# EAGLE design giri-fu-hw (EAGLE 7.7.0)
giri-fu hardware v1.0
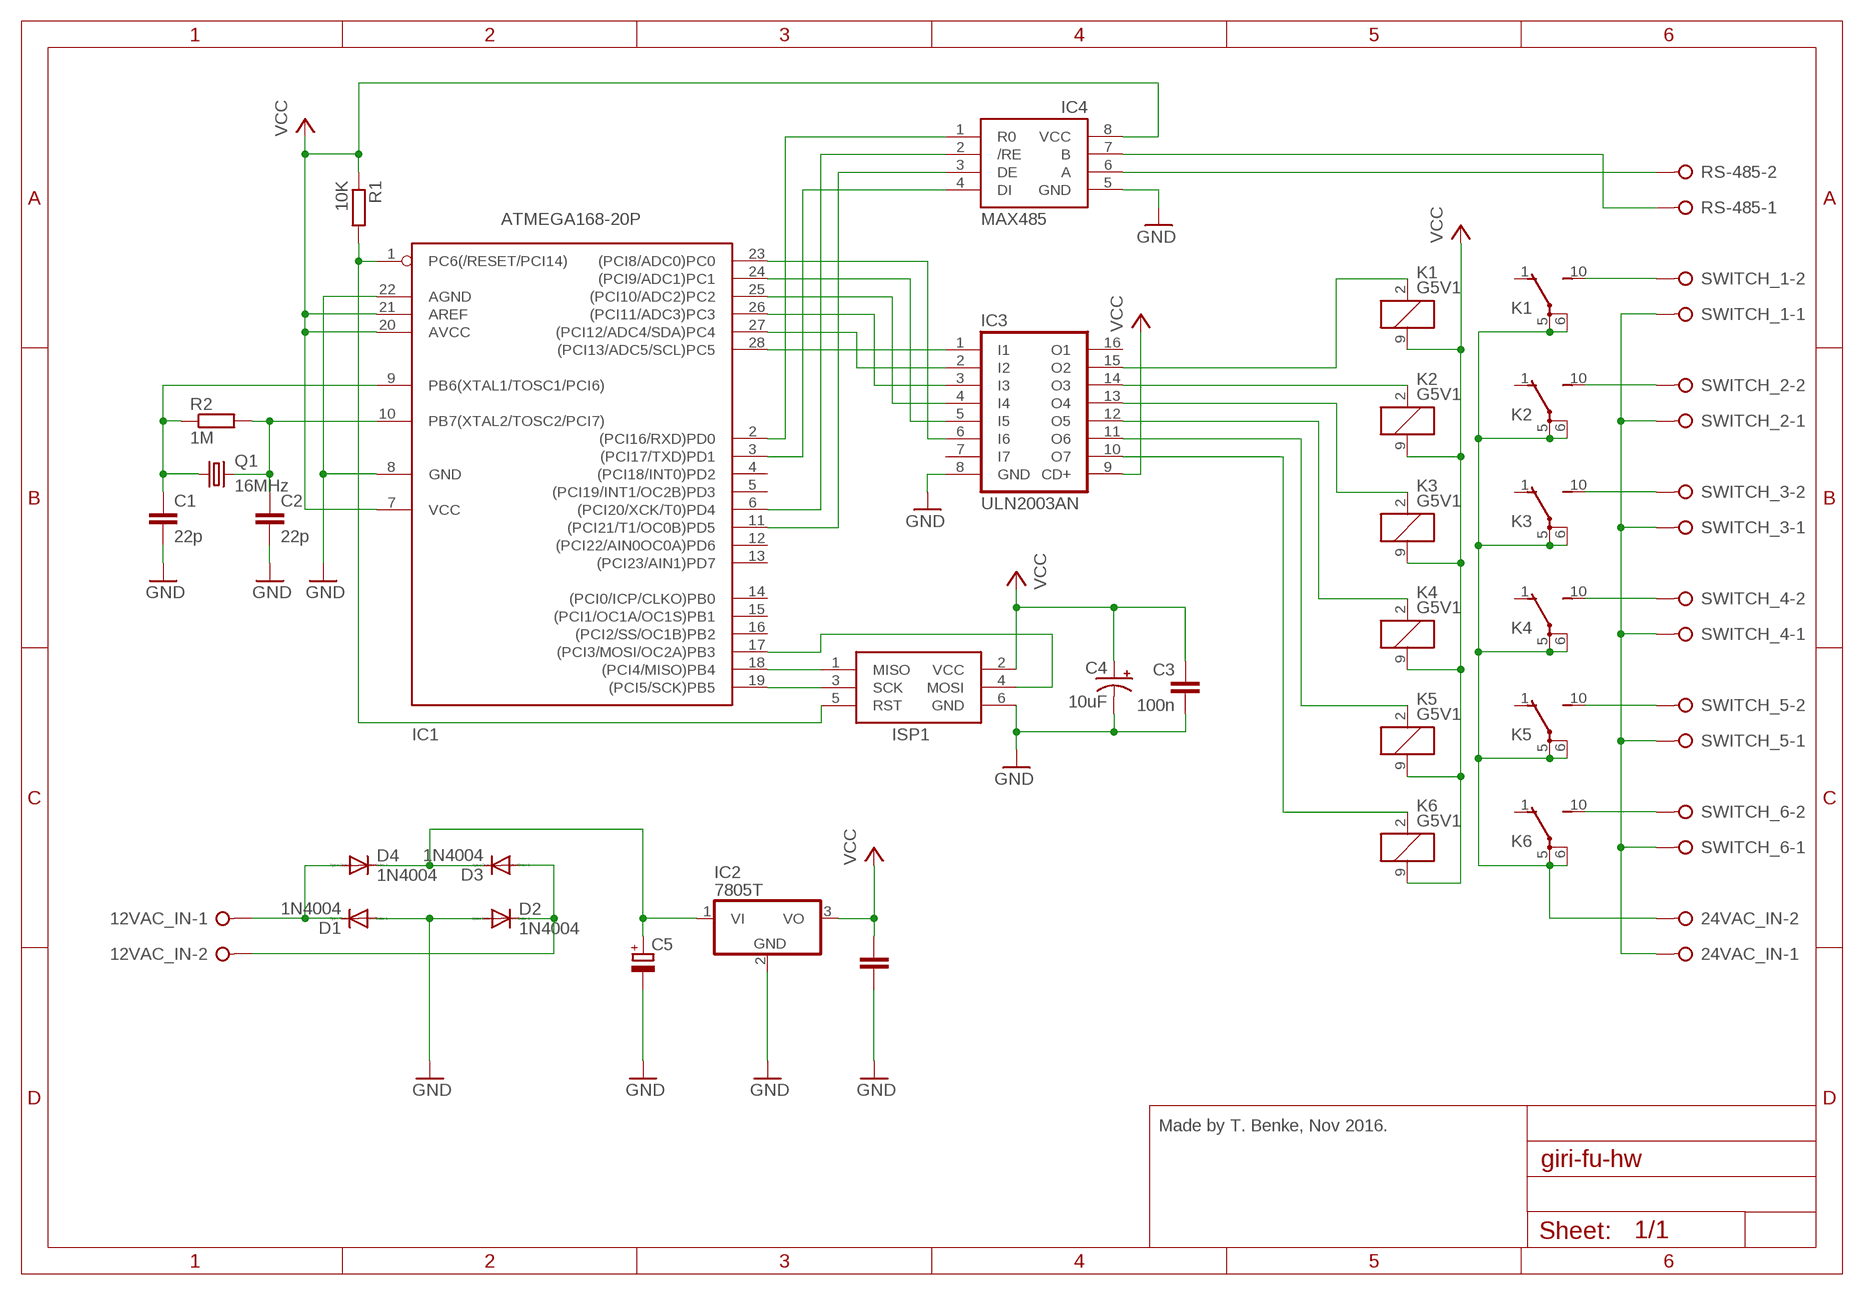
[diagram p0: schematic, sheet 1]

## Parts
12VAC_IN  W237-02P  [W237-132]
24VAC_IN  W237-02P  [W237-132]
C1  22p  C-EU025-025X050  [C025-025X050]
C2  22p  C-EU025-025X050  [C025-025X050]
C3  100n  C-EU025-025X050  [C025-025X050]
C4  10uF  CPOL-USE2-5  [E2-5]
C5  CPOL-EUE35-12AXIAL  [E35-12]
D1  1N4004  [DO41-10]
D2  1N4004  [DO41-10]
D3  1N4004  [DO41-10]
D4  1N4004  [DO41-10]
IC1  ATMEGA168-20P  [DIL28-3]
IC2  7805T  [TO220H]
IC3  ULN2003AN  [DIL16]
IC4  MAX485  [DIL08]
ISP1  AVRISP-6  [AVRISP]
K1  G5V1  [G5V1]
K2  G5V1  [G5V1]
K3  G5V1  [G5V1]
K4  G5V1  [G5V1]
K5  G5V1  [G5V1]
K6  G5V1  [G5V1]
Q1  16MHz  CRYSTALHC49U-V  [HC49U-V]
R1  10K  R-EU_0207/10  [0207/10]
R2  1M  R-EU_0207/10  [0207/10]
RS-485  W237-02P  [W237-132]
SWITCH_1  W237-02P  [W237-132]
SWITCH_2  W237-02P  [W237-132]
SWITCH_3  W237-02P  [W237-132]
SWITCH_4  W237-02P  [W237-132]
SWITCH_5  W237-02P  [W237-132]
SWITCH_6  W237-02P  [W237-132]

## Nets
GND: C1.2 C2.2 C3.2 C4.- C5.- D1.A D2.A IC1.8(GND) IC1.22(AGND) IC2.2(GND) IC3.8(GND) IC4.5(GND) ISP1.6(GND)
N$1: IC1.23((PCI8/ADC0)PC0) IC3.6(I6)
N$2: IC1.24((PCI9/ADC1)PC1) IC3.5(I5)
N$3: 24VAC_IN.2 K1.5(2:P) K1.6(2:P) K2.5(2:P) K2.6(2:P) K3.5(2:P) K3.6(2:P) K4.5(2:P) K4.6(2:P) K5.5(2:P) K5.6(2:P) K6.5(2:P) K6.6(2:P)
N$4: IC1.25((PCI10/ADC2)PC2) IC3.4(I4)
N$5: IC1.28((PCI13/ADC5/SCL)PC5) IC3.1(I1)
N$6: IC1.26((PCI11/ADC3)PC3) IC3.3(I3)
N$7: IC1.27((PCI12/ADC4/SDA)PC4) IC3.2(I2)
N$8: C3.1 C4.+ IC1.7(VCC) IC1.20(AVCC) IC1.21(AREF) IC2.3(VO) IC3.9(CD+) IC4.8(VCC) ISP1.2(VCC) K1.9 K2.9 K3.9 K4.9 K5.9 K6.9 R1.1 ; supply symbol labelled VCC
N$9: IC3.10(O7) K6.2
N$10: IC3.11(O6) K5.2
N$11: IC1.19((PCI5/SCK)PB5) ISP1.3(SCK)
N$12: IC1.17((PCI3/MOSI/OC2A)PB3) ISP1.4(MOSI)
N$13: IC1.1(PC6(/RESET/PCI14)) ISP1.5(RST) R1.2
N$14: C1.1 IC1.9(PB6(XTAL1/TOSC1/PCI6)) Q1.1 R2.1
N$15: C2.1 IC1.10(PB7(XTAL2/TOSC2/PCI7)) Q1.2 R2.2
N$16: IC1.18((PCI4/MISO)PB4) ISP1.1(MISO)
N$17: IC3.12(O5) K4.2
N$18: IC3.13(O4) K3.2
N$19: IC3.14(O3) K2.2
N$20: IC3.15(O2) K1.2
N$21: C5.+ D3.C D4.C IC2.1(VI)
N$22: 12VAC_IN.1 D1.C D4.A
N$23: 12VAC_IN.2 D2.C D3.A
N$24: IC4.6(A) RS-485.2
N$25: IC4.7(B) RS-485.1
N$26: IC1.2((PCI16/RXD)PD0) IC4.1(R0)
N$27: IC1.3((PCI17/TXD)PD1) IC4.4(DI)
N$28: K1.10(2:S) SWITCH_1.2
N$29: K2.10(2:S) SWITCH_2.2
N$30: K3.10(2:S) SWITCH_3.2
N$31: K4.10(2:S) SWITCH_4.2
N$32: K5.10(2:S) SWITCH_5.2
N$33: K6.10(2:S) SWITCH_6.2
N$35: 24VAC_IN.1 SWITCH_1.1 SWITCH_2.1 SWITCH_3.1 SWITCH_4.1 SWITCH_5.1 SWITCH_6.1
N$36: IC1.6((PCI20/XCK/T0)PD4) IC4.2(/RE)
N$38: IC1.11((PCI21/T1/OC0B)PD5) IC4.3(DE)
Unconnected: IC1.4((PCI18/INT0)PD2) IC1.5((PCI19/INT1/OC2B)PD3) IC1.12((PCI22/AIN0OC0A)PD6) IC1.13((PCI23/AIN1)PD7) IC1.14((PCI0/ICP/CLKO)PB0) IC1.15((PCI1/OC1A/OC1S)PB1) IC1.16((PCI2/SS/OC1B)PB2) IC3.7(I7) IC3.16(O1) K1.1(2:O) K2.1(2:O) K3.1(2:O) K4.1(2:O) K5.1(2:O) K6.1(2:O)

## Notes on the sheet
- Made by T. Benke, Nov 2016.

## Library data of the parts
12VAC_IN 24VAC_IN RS-485 SWITCH_1-SWITCH_6 = con-wago-508:W237-02P: WAGO SREW CLAMP; OC_FARNELL: unknown; OC_NEWARK: unknown
C1-C3 = rcl:C-EU: CAPACITOR, European symbol
C4 = adafruit:CPOL-US: POLARIZED CAPACITOR, American symbol
C5 = rcl:CPOL-EU: POLARIZED CAPACITOR, European symbol
D1-D4 = diode:1N4004: DIODE general purpose rectifier, 1 A
IC1 = adafruit:ATMEGA168*P: MICROCONTROLLER 16 kBytes FLASH 1 kBytes SRAM 512 Bytes EEPROM USART 8-channel 10 bit ADC
IC2 = linear:78*: Positive VOLTAGE REGULATOR Source: http://cache.national.com/ds/LM/LM78L05.pdf http://www.fairchildsemi.com/ds/LM/LM7805.pdf
IC3 = uln-udn:ULN2003A: DRIVER ARRAY
IC4 = max485:MAX485: MAX485; MANUFACTURER_PARTNO: MAX485ECPA+; MOUSER_PARTNO: MAX485ECPA+
ISP1 = adafruit:AVRISP: AVR ISP HEADER Standard 6 pin header for AVR programming
K1-K6 = relay:G5V1: RELAY 1 x switch, 0.5 A/125 V AC, 1 A/24 V DC , Omron; MPN: G5V-1-DC24; OC_FARNELL: 9949593; OC_NEWARK: 36M6377
Q1 = adafruit:CRYSTAL: CRYSTAL; OC_FARNELL: 1666969; OC_NEWARK: unknown
R1 R2 = rcl:R-EU_: RESISTOR, European symbol

## Board
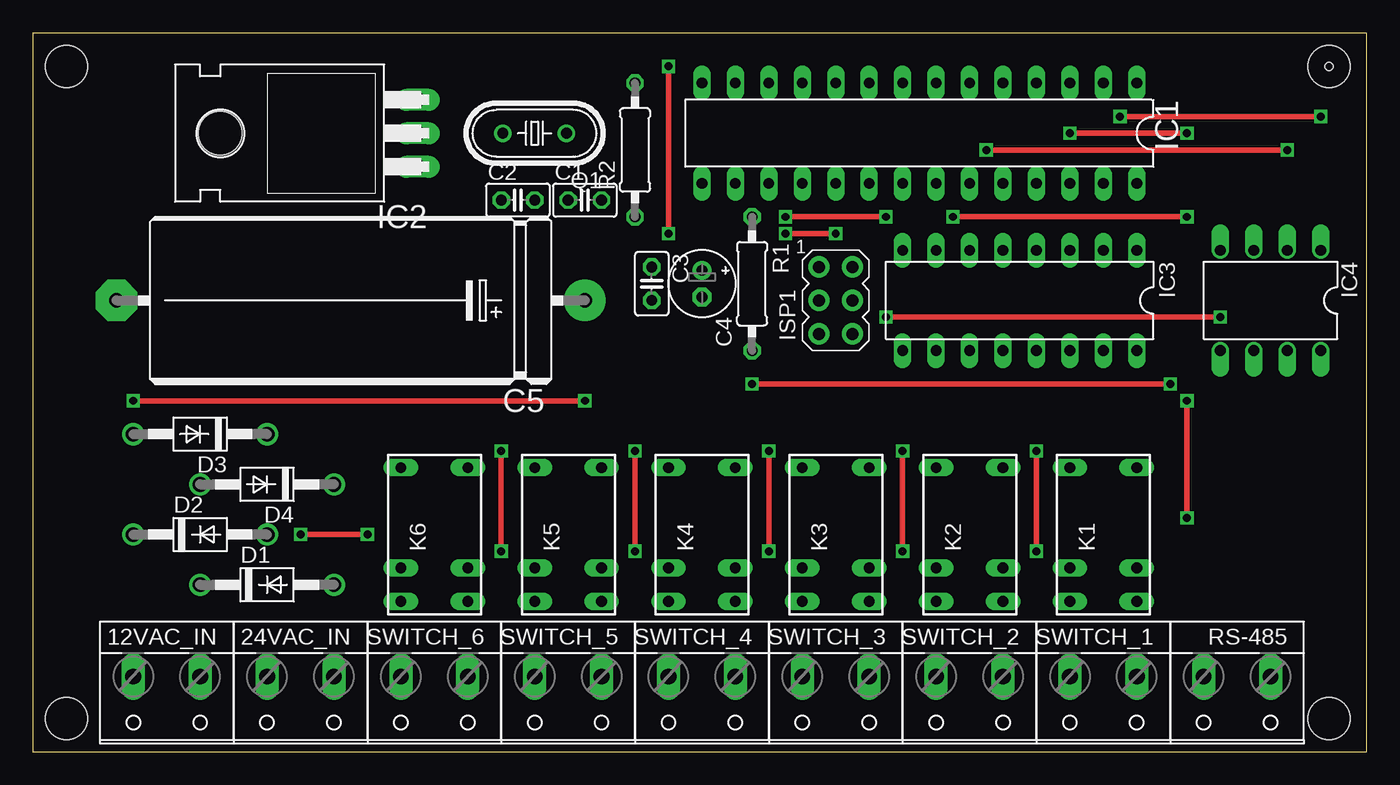
[diagram p1: board, top side]
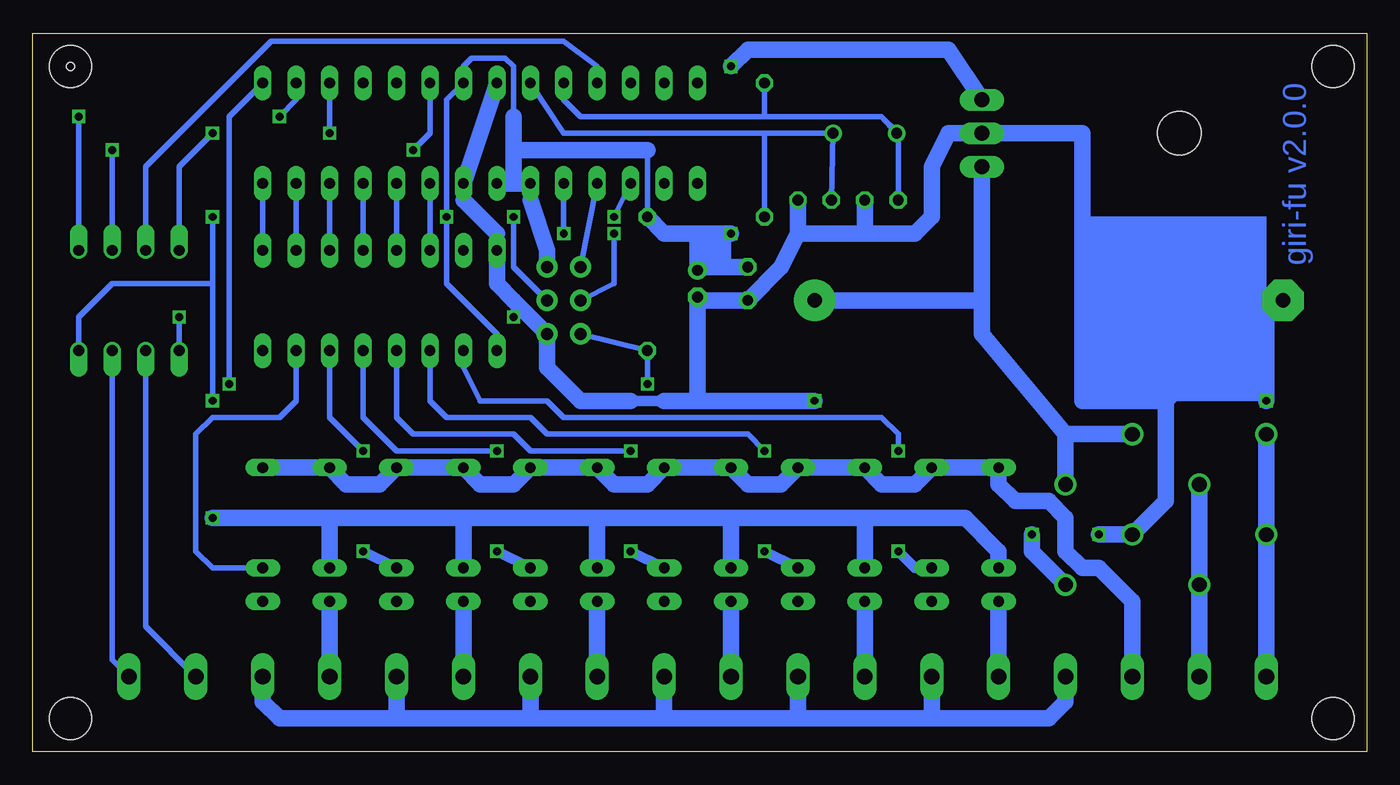
[diagram p2: board, bottom side, seen from below]

Size 101.27 x 54.6 mm. Coordinates in mm from the lower left corner, seen from the top.
Outline: 0,0 101.27,0 101.27,54.6 0,54.6 0,0
Copper layers (1*16): Top 0.035mm / dielectric 1.5mm / Bottom 0.035mm
Design rules "default": minimum track width 10mil, minimum drill 24mil, track to track 8mil, track to pad 8mil, pad to pad 8mil, via to via 8mil, smd to smd 8mil, copper to edge 40mil, drill to drill 8mil, minimum pad ring 10mil, minimum via ring 8mil, stop-mask expansion 4mil, vias tented up to drill 0mil, thermal gap 10mil
Holes 3.2 mm at 98.42,2.54 2.54,2.54 2.54,52.07 98.42,52.07
Holes 0.6 mm at 98.42,52.07

### Footprints (pad centres in the part's own frame; a part is rotated, then mirrored left to right if it is on the bottom)
W237-132 = drill 1.194 long: 1 -2.54,-0.635; 2 2.54,-0.635
C025-025X050 = drill 0.813 octagon: 1 -1.27,0; 2 1.27,0
E2-5 = drill 0.813 pad 1.422: + -1.016,0 | drill 0.813 pad 1.422 octagon: - 1.016,0
E35-12 = drill 1.118 pad 3.15: + -17.78,0 | drill 1.118 pad 3.15 octagon: - 17.78,0
DO41-10 = drill 1.118: A 5.08,0; C -5.08,0
DIL28-3 = drill 0.813 long: 1 -16.51,-3.81; 2 -13.97,-3.81; 3 -11.43,-3.81; 4 -8.89,-3.81; 5 -6.35,-3.81; 6 -3.81,-3.81; 7 -1.27,-3.81; 8 1.27,-3.81; 9 3.81,-3.81; 10 6.35,-3.81; 11 8.89,-3.81; 12 11.43,-3.81; 13 13.97,-3.81; 14 16.51,-3.81; 15 16.51,3.81; 16 13.97,3.81; 17 11.43,3.81; 18 8.89,3.81; 19 6.35,3.81; 20 3.81,3.81; 21 1.27,3.81; 22 -1.27,3.81; 23 -3.81,3.81; 24 -6.35,3.81; 25 -8.89,3.81; 26 -11.43,3.81; 27 -13.97,3.81; 28 -16.51,3.81
TO220H = drill 1.118 long: 1 -2.54,-10.16; 2 0,-10.16; 3 2.54,-10.16 | hole 3.302: 0,4.826
DIL16 = drill 0.813 long: 1 -8.89,-3.81; 2 -6.35,-3.81; 3 -3.81,-3.81; 4 -1.27,-3.81; 5 1.27,-3.81; 6 3.81,-3.81; 7 6.35,-3.81; 8 8.89,-3.81; 9 8.89,3.81; 10 6.35,3.81; 11 3.81,3.81; 12 1.27,3.81; 13 -1.27,3.81; 14 -3.81,3.81; 15 -6.35,3.81; 16 -8.89,3.81
DIL08 = drill 0.813 offset: 1 -3.81,-3.81; 2 -1.27,-3.81; 3 1.27,-3.81; 4 3.81,-3.81; 5 3.81,3.81; 6 1.27,3.81; 7 -1.27,3.81; 8 -3.81,3.81
AVRISP = drill 0.9 pad 1.626: 1 -1.27,2.54; 2 1.27,2.54; 3 -1.27,0; 4 1.27,0; 5 -1.27,-2.54; 6 1.27,-2.54
G5V1 = drill 0.813 long: 1 -5.08,-2.54; 2 -2.54,-2.54; 5 5.08,-2.54; 6 5.08,2.54; 9 -2.54,2.54; 10 -5.08,2.54
HC49U-V = drill 0.813: 1 -2.413,0; 2 2.413,0
0207/10 = drill 0.813 octagon: 1 -5.08,0; 2 5.08,0

### Placement (x,y rotation side)
12VAC_IN  10.16,5.08 180 top
24VAC_IN  20.32,5.08 180 top
C1  41.91,41.91 0 top
C2  36.83,41.91 0 top
C3  46.99,35.56 270 top
C4  50.8,35.56 270 top
C5  24.13,34.29 180 top
D1  17.78,12.7 0 top
D2  12.7,16.51 0 top
D3  12.7,24.13 180 top
D4  17.78,20.32 180 top
IC1  67.31,46.99 180 top
IC2  19.05,46.99 90 top
IC3  74.93,34.29 180 top
IC4  93.98,34.29 180 top
ISP1  60.96,34.29 0 top
K1  81.28,16.51 90 top
K2  71.12,16.51 90 top
K3  60.96,16.51 90 top
K4  50.8,16.51 90 top
K5  40.64,16.51 90 top
K6  30.48,16.51 90 top
Q1  38.1,46.99 180 top
R1  54.61,35.56 270 top
R2  45.72,45.72 90 top
RS-485  91.44,5.08 180 top
SWITCH_1  81.28,5.08 180 top
SWITCH_2  71.12,5.08 180 top
SWITCH_3  60.96,5.08 180 top
SWITCH_4  50.8,5.08 180 top
SWITCH_5  40.64,5.08 180 top
SWITCH_6  30.48,5.08 180 top

### Tracks (layer width: path | path; a pad name or v marks a point on that pad's centre or on a via)
GND  (via drill 0.6)
  Top 0.406: v20.32,16.51 v25.4,16.51 | v41.91,26.67 v7.62,26.67 | v90.17,33.02 v64.77,33.02
  Bottom 0.406: 7.62,34.29 C5.- | IC1.22 68.58,41.91 | 66.04,39.37 IC3.8 | IC4.5 v90.17,33.02 | v64.77,33.02 64.77,34.29
  Bottom 0.813: 55.88,26.67 53.34,26.67
  Bottom 1.27: 15.24,26.67 21.59,26.67 21.59,46.99 IC2.2 31.75,46.99 33.02,44.45 33.02,40.64 34.29,39.37 38.1,39.37 | 15.24,26.67 7.62,34.29 v7.62,26.67 | 68.58,41.91 66.04,39.37 | 38.1,39.37 C2.2 | v20.32,16.51 D2.A 15.24,19.05 15.24,26.67 | v25.4,16.51 25.4,15.24 D1.A | 55.88,26.67 59.69,26.67 62.23,29.21 ISP1.6 64.77,34.29 66.04,35.56 IC3.8 | 53.34,26.67 50.8,26.67 | 50.8,26.67 C4.- 50.8,34.29 C3.2 44.45,36.83 43.18,39.37 | IC1.8 IC1.22 | 43.18,39.37 38.1,39.37 | C1.2 43.18,39.37 | 50.8,26.67 v41.91,26.67
N$1
  Bottom 0.406: IC1.23 IC3.6
N$2
  Bottom 0.406: IC1.24 IC3.5
N$3
  Bottom 1.27: K1.5 K1.6 77.47,20.32 74.93,20.32 K2.5 K2.6 67.31,20.32 64.77,20.32 K3.5 K3.6 57.15,20.32 54.61,20.32 K4.5 K4.6 46.99,20.32 44.45,20.32 K5.5 K5.6 36.83,20.32 34.29,20.32 K6.5 K6.6 27.94,20.32 26.67,19.05 24.13,19.05 22.86,17.78 22.86,15.24 21.59,13.97 20.32,13.97 17.78,11.43 24VAC_IN.2
N$4
  Bottom 0.406: IC1.25 IC3.4
N$5
  Bottom 0.406: IC1.28 IC3.1
N$6
  Bottom 0.406: IC1.26 IC3.3
N$7
  Bottom 0.406: IC1.27 IC3.2
N$8  (via drill 0.6)
  Top 0.406: v48.26,52.07 v48.26,39.37 | v69.85,40.64 v87.63,40.64 | v87.63,26.67 v87.63,17.78
  Bottom 0.406: IC1.20 63.5,41.91 | 64.77,48.26 64.77,52.07 65.41,52.7 67.94,52.7 68.58,52.07 IC1.7 69.85,49.53 v69.85,40.64 69.85,35.56 66.04,31.75 IC3.9 | R1.1 54.61,45.72 | v87.63,40.64 87.63,35.56 | 87.63,35.56 v87.63,26.67 | IC4.8 97.79,33.02 95.25,35.56 87.63,35.56
  Bottom 1.27: C4.+ 50.8,36.83 | 50.8,39.37 53.34,39.37 R1.1 | IC1.21 64.77,43.18 | 64.77,43.18 IC1.20 | 63.5,41.91 62.23,38.1 ISP1.2 | 64.77,48.26 64.77,45.72 | 64.77,45.72 64.77,43.18 | 54.61,45.72 64.77,45.72 | IC2.3 31.75,53.34 46.99,53.34 v48.26,52.07 | v48.26,39.37 50.8,39.37 | 50.8,39.37 50.8,36.83 | 50.8,36.83 C3.1 | K6.9 27.94,15.24 30.48,17.78 38.1,17.78 | 38.1,17.78 48.26,17.78 | 48.26,17.78 58.42,17.78 | 58.42,17.78 68.58,17.78 | 68.58,17.78 78.74,17.78 | 78.74,17.78 K1.9 | K2.9 68.58,17.78 | K3.9 58.42,17.78 | K4.9 48.26,17.78 | K5.9 38.1,17.78 | v87.63,17.78 78.74,17.78
N$9  (2 unrouted)
  Top 0.406: 35.56,15.24 35.56,22.86
  Bottom 0.406: K6.2 34.29,13.97 | 35.56,22.86 35.56,24.13 36.83,25.4 60.96,25.4 62.23,26.67 67.31,26.67 68.58,29.21 IC3.10
  Bottom 0.813: 34.29,13.97 35.56,15.24
N$10  (via drill 0.6)  (1 unrouted)
  Top 0.406: 45.72,15.24 v45.72,22.86
  Bottom 0.406: v45.72,22.86 46.99,24.13 62.23,24.13 63.5,25.4 69.85,25.4 71.12,26.67 IC3.11
  Bottom 0.813: K5.2 45.72,15.24
N$11  (via drill 0.6)
  Top 0.406: v60.96,39.37 v57.15,39.37
  Bottom 0.406: IC1.19 v60.96,39.37 | v57.15,39.37 57.15,35.56 ISP1.3
N$12  (via drill 0.6)
  Top 0.406: v57.15,40.64 v64.77,40.64
  Bottom 0.406: IC1.17 v57.15,40.64 | v64.77,40.64 64.77,36.83 ISP1.4
N$13  (via drill 0.6)
  Top 0.406: v86.36,27.94 v54.61,27.94
  Bottom 0.406: ISP1.5 R1.2 v54.61,27.94 | IC1.1 86.36,48.26 v86.36,27.94
N$14
  Bottom 0.406: IC1.9 60.96,46.99 45.72,46.99 | 45.72,46.99 Q1.1 C1.1 | R2.1 45.72,46.99
N$15
  Bottom 0.406: C2.1 35.56,46.99 | 35.56,46.99 36.83,48.26 | 36.83,48.26 45.72,48.26 | 45.72,48.26 R2.2 | 35.56,46.99 Q1.2 36.83,48.26 | IC1.10 60.96,49.53 59.69,48.26 45.72,48.26
N$16
  Bottom 0.406: IC1.18 ISP1.1
N$17  (via drill 0.6)
  Top 0.406: v55.88,15.24 v55.88,22.86
  Bottom 0.406: v55.88,22.86 63.5,22.86 64.77,24.13 72.39,24.13 73.66,25.4 IC3.12
  Bottom 0.813: K4.2 v55.88,15.24
N$18  (via drill 0.6)  (1 unrouted)
  Top 0.406: 66.04,15.24 v66.04,22.86
  Bottom 0.406: v66.04,22.86 73.66,22.86 76.2,25.4 IC3.13
  Bottom 0.813: K3.2 66.04,15.24
N$19  (via drill 0.6)
  Top 0.406: v76.2,22.86 v76.2,15.24
  Bottom 0.406: IC3.14 78.74,25.4 v76.2,22.86
  Bottom 0.813: K2.2 v76.2,15.24
N$20
  Bottom 0.406: K1.2 87.63,13.97 88.9,15.24 88.9,24.13 87.63,25.4 82.55,25.4 81.28,26.67 IC3.15
N$21
  Bottom 0.406: IC2.1 29.21,34.29
  Bottom 1.27: D4.C 22.86,24.13 | 22.86,24.13 D3.C | 29.21,34.29 C5.+ | IC2.1 29.21,31.75 22.86,24.13
N$22
  Bottom 1.27: D4.A D1.C 12VAC_IN.1
N$23
  Bottom 1.27: D3.A D2.C 12VAC_IN.2
N$24
  Bottom 0.406: IC4.6 92.71,9.53 RS-485.2
N$25
  Bottom 0.406: IC4.7 95.25,6.99 RS-485.1
N$26  (via drill 0.6)
  Top 0.406: v82.55,48.26 v97.79,48.26
  Bottom 0.406: IC1.2 81.28,49.53 v82.55,48.26 | v97.79,48.26 IC4.1
N$27  (via drill 0.6)
  Top 0.406: v78.74,46.99 v87.63,46.99
  Bottom 0.406: IC1.3 v78.74,46.99 | v87.63,46.99 90.17,44.45 IC4.4
N$28
  Bottom 1.27: K1.10 SWITCH_1.2
N$29
  Bottom 1.27: K2.10 SWITCH_2.2
N$30
  Bottom 1.27: K3.10 SWITCH_3.2
N$31
  Bottom 1.27: K4.10 SWITCH_4.2
N$32
  Bottom 1.27: K5.10 SWITCH_5.2
N$33
  Bottom 1.27: K6.10 SWITCH_6.2
N$34  (via drill 0.6)
  other vias: 35.56,22.86
N$35
  Bottom 1.27: SWITCH_1.1 83.82,3.81 82.55,2.54 73.66,2.54 | 73.66,2.54 63.5,2.54 | 63.5,2.54 53.34,2.54 | 53.34,2.54 43.18,2.54 | 43.18,2.54 33.02,2.54 | 33.02,2.54 24.13,2.54 22.86,3.81 24VAC_IN.1 | SWITCH_6.1 33.02,2.54 | SWITCH_5.1 43.18,2.54 | SWITCH_4.1 53.34,2.54 | SWITCH_3.1 63.5,2.54 | SWITCH_2.1 73.66,2.54
N$36  (via drill 0.6)
  Top 0.406: v72.39,45.72 v95.25,45.72
  Bottom 0.406: IC1.6 71.12,46.99 v72.39,45.72 | v95.25,45.72 IC4.2
N$37  (via drill 0.6)
  other vias: 66.04,15.24
N$38
  Bottom 0.406: IC1.11 58.42,52.07 60.96,53.98 83.19,53.98 92.71,44.45 IC4.3
N$39  (via drill 0.6)
  other vias: 45.72,15.24
N$40  (via drill 0.6)
  other vias: 35.56,15.24
N$41  (via drill 0.6)
  other vias: 20.32,16.51
(copper drawn outside any net)
  shapes: Bottom area x3

### Text on the board
Bottom: giri-fu v2.0.0
_tNames: IC2 | Q1 | IC1 | R2 | C2 | C1 | R1 | C4 | IC3 | C3 | ISP1 | C5 | D3 | D4 | D2 | K6 | K5 | K4 | K3 | K2 | K1 | D1 | X17 | X16 | X15 | X14 | X13 | X12 | X11 | X10